# EasyEDA schematic Placa de enseñanza.json
TITLE: Sheet_1; REV: 1.0; Date: 2024-09-28; Sheet: 1/1; Drawn By: j3138000914santi; Company: Your Company
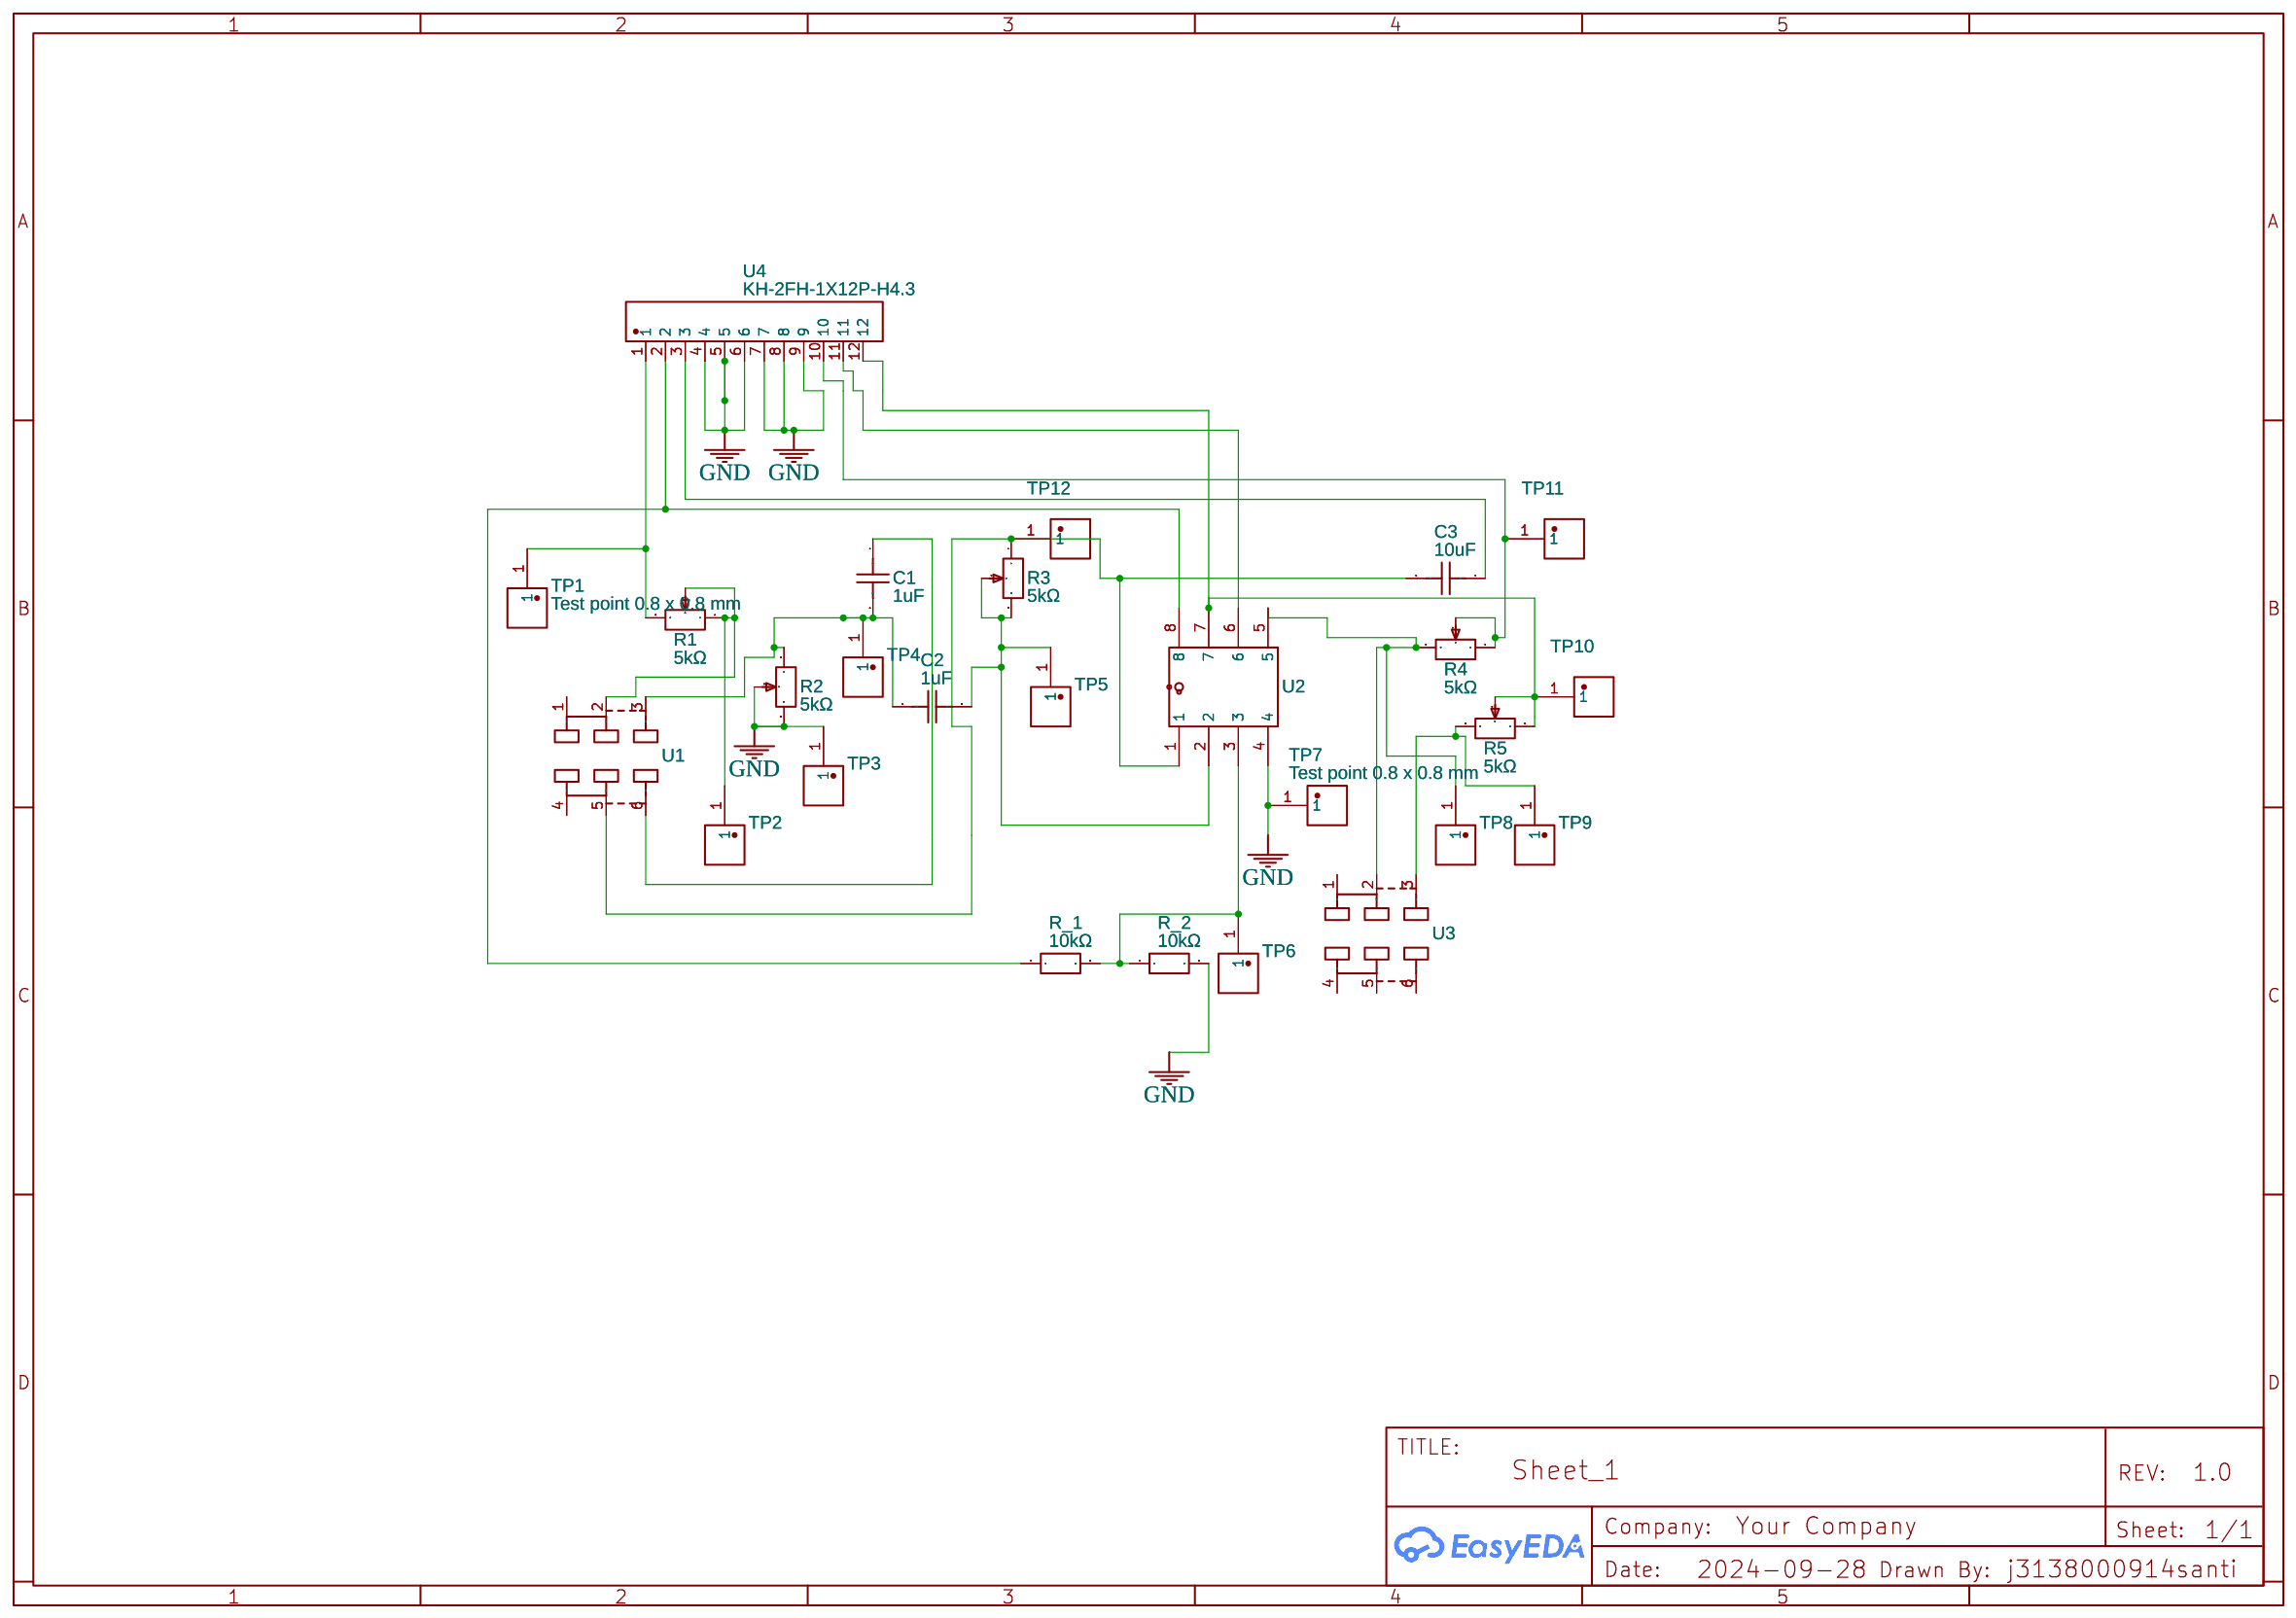
[diagram p0: schematic sheet]

## Parts
C1  1uF  [C0805]
C2  1uF  [C0805]
C3  10uF  [C0805]
R1  5kΩ  [RES-ADJ-TH_3P-L6.6-W7.0-P2.54-L_3362P]
R2  5kΩ  [RES-ADJ-TH_3P-L6.6-W7.0-P2.54-L_3362P]
R3  5kΩ  [RES-ADJ-TH_3P-L6.6-W7.0-P2.54-L_3362P]
R4  5kΩ  [RES-ADJ-TH_3P-L6.6-W7.0-P2.54-L_3362P]
R5  5kΩ  [RES-ADJ-TH_3P-L6.6-W7.0-P2.54-L_3362P]
R_1  10kΩ  [R0805]
R_2  10kΩ  [R0805]
TP1  Test point 0.8 x 0.8 mm  [PAD SMD 0.8 X 0.8 MM]
TP2  Test point 0.8 x 0.8 mm  [PAD SMD 0.8 X 0.8 MM]
TP3  Test point 0.8 x 0.8 mm  [PAD SMD 0.8 X 0.8 MM]
TP4  Test point 0.8 x 0.8 mm  [PAD SMD 0.8 X 0.8 MM]
TP5  Test point 0.8 x 0.8 mm  [PAD SMD 0.8 X 0.8 MM]
TP6  Test point 0.8 x 0.8 mm  [PAD SMD 0.8 X 0.8 MM]
TP7  Test point 0.8 x 0.8 mm  [PAD SMD 0.8 X 0.8 MM]
TP8  Test point 0.8 x 0.8 mm  [PAD SMD 0.8 X 0.8 MM]
TP9  Test point 0.8 x 0.8 mm  [PAD SMD 0.8 X 0.8 MM]
TP10  Test point 0.8 x 0.8 mm  [PAD SMD 0.8 X 0.8 MM]
TP11  Test point 0.8 x 0.8 mm  [PAD SMD 0.8 X 0.8 MM]
TP12  Test point 0.8 x 0.8 mm  [PAD SMD 0.8 X 0.8 MM]
U1  HX MSS22D18G2  [SW-TH_SHOU_MSS22D18G2]
U2  8 Pin DIP Socket  [8 PIN DIP SOCKET]
U3  HX MSS22D18G2  [SW-TH_SHOU_MSS22D18G2]
U4  KH-2FH-1X12P-H4.3  [CONN-TH_12P-P2.00_KINGHELM_KH-2FH-1X12P-H4.3]

## Library data of the parts
C1 C2 = CT41G-0805-2X1-50V-1μF-K(N): Contributor: LCSC; JLCPCB Part Class: Extended Part; Supplier: LCSC; Supplier Part: C141772; Manufacturer: TORCH(火炬)
C3 = C0805X5R106K160NT: Contributor: LCSC; Supplier: LCSC; Supplier Part: C466793; Manufacturer: SANYEAR(叁叶源); JLCPCB Part Class: Extended Part
R1-R5 = 3362P-1-502LF: Resistance(Ohms): 5K; Supplier: LCSC; Manufacturer: BOURNS; Supplier Part: C81260; JLCPCB Part Class: Extended Part
R_1 R_2 = CR0805-8W-103JT: Supplier: LCSC; Supplier Part: C4325178; Manufacturer: Venkel; JLCPCB Part Class: Extended Part; Contributor: lcsc
TP1-TP12 = Test point 0.8 x 0.8 mm: Contributor: jmmarson
U1 U3 = HX MSS22D18G2: Contributor: lcsc; Supplier: LCSC; Supplier Part: C5149820; Manufacturer: hanxia(韩下); JLCPCB Part Class: Extended Part
U2 = 8 Pin DIP Socket: Manufacturer Part: New SchematicLib; Contributor: Hida Suryo; link: https://www.amazon.ca/2-54mm-Board-Solder-Socket-Adapter/dp/B00OK5Z96Q/ref=sr_1_14?ie=UTF8&qid=1529534375&sr=8-14&keywords=dip+socket
U4 = KH-2FH-1X12P-H4.3: Contributor: LCSC; Supplier: LCSC; Supplier Part: C2938435; Manufacturer: kinghelm(金航标); JLCPCB Part Class: Extended Part

## Nets
GND: R2.2 R2.3 R_2.2 TP3.1 TP7.1 U2.4 U4.4 U4.5 U4.6 U4.7 U4.8 U4.9
Net-(C1-1): C1.1 U1.6
Net-(C1-2): C1.2 C2.1 R2.1 TP4.1 U1.3
Net-(C2-2): C2.2 R3.2 R3.3 TP5.1 U2.2
Net-(C3-1): C3.1 U4.3
Net-(C3-2): C3.2 R3.1 TP12.1 U1.5 U2.1
Net-(R1-1): R1.1 R1.2 TP2.1 U1.2
Net-(R1-3): R1.3 TP1.1 U4.1
Net-(R4-1): R4.1 R4.2 TP11.1 U4.10
Net-(R4-3): R4.3 TP8.1 U2.5 U3.2
Net-(R5-1): R5.1 R5.2 TP10.1 U2.7 U4.12
Net-(R5-3): R5.3 TP9.1 U3.3
Net-(R_1-1): R_1.1 U2.8 U4.2
Net-(R_1-2): R_1.2 R_2.1 TP6.1 U2.3
Net-(U2-6): U2.6 U4.11

Not connected (* = marked no-connect by the designer): U1 1 4; U3 1 4 5 6
